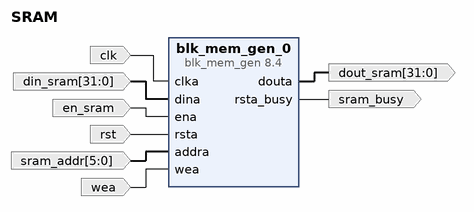
[diagram p0: block diagram of the top level]
# Vivado block design SRAM, xc7z010clg400-1, Vivado 2022.2
create_bd_design SRAM

create_bd_port -dir I clk
create_bd_port -dir I -from 31 -to 0 din_sram
create_bd_port -dir I -from 5 -to 0 sram_addr
create_bd_port -dir I wea
create_bd_port -dir I rst
create_bd_port -dir I en_sram
create_bd_port -dir O sram_busy
create_bd_port -dir O -from 31 -to 0 dout_sram

create_bd_cell -type ip -vlnv xilinx.com:ip:blk_mem_gen:8.4 blk_mem_gen_0
set_property -dict [list \
  CONFIG.Fill_Remaining_Memory_Locations true \
  CONFIG.Register_PortA_Output_of_Memory_Primitives false \
  CONFIG.Use_Byte_Write_Enable false \
  CONFIG.Use_RSTA_Pin true \
  CONFIG.Write_Depth_A 64 \
  CONFIG.Write_Width_A 32 \
  CONFIG.use_bram_block Stand_Alone \
] [get_bd_cells blk_mem_gen_0]

# ---- connections ----

connect_bd_net [get_bd_pins blk_mem_gen_0/douta] [get_bd_ports dout_sram]
connect_bd_net [get_bd_pins blk_mem_gen_0/rsta_busy] [get_bd_ports sram_busy]
connect_bd_net [get_bd_ports clk] [get_bd_pins blk_mem_gen_0/clka]
connect_bd_net [get_bd_ports din_sram] [get_bd_pins blk_mem_gen_0/dina]
connect_bd_net [get_bd_ports en_sram] [get_bd_pins blk_mem_gen_0/ena]
connect_bd_net [get_bd_ports rst] [get_bd_pins blk_mem_gen_0/rsta]
connect_bd_net [get_bd_ports sram_addr] [get_bd_pins blk_mem_gen_0/addra]
connect_bd_net [get_bd_ports wea] [get_bd_pins blk_mem_gen_0/wea]

validate_bd_design
save_bd_design
